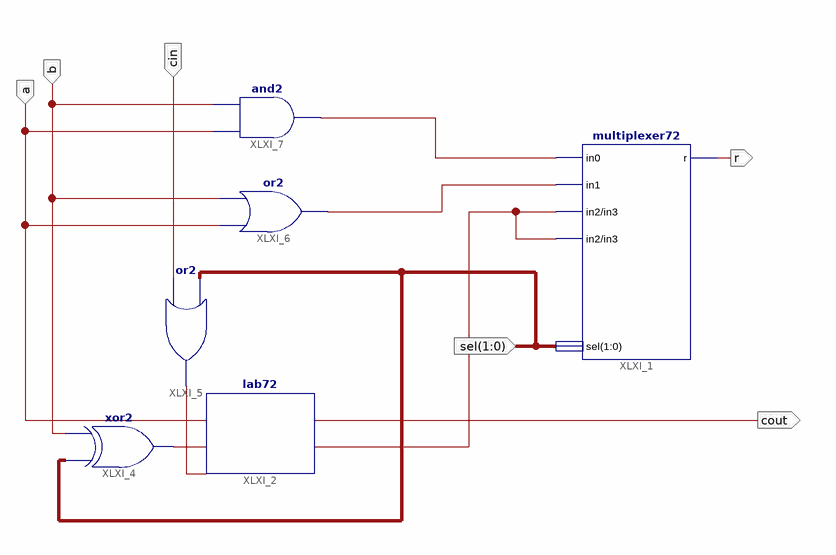
[diagram p0: schematic sheet 1]
// Xilinx ISE schematic lab72sch.sch (artix7) as structural Verilog: 6 symbols, 6 ports
module lab72sch (
  input  b,
  input  cin,
  input  a,
  input  [1:0] sel,
  output r,
  output cout
);

  wire XLXN_3, XLXN_6, XLXN_7, XLXN_8, XLXN_9;

  multiplexer72 XLXI_1 (.in0(XLXN_9), .in1(XLXN_8), .in2(XLXN_3), .in3(XLXN_3), .sel(sel), .r(r));
  lab72 XLXI_2 ();  // open: a, b, cin, cout, s
  assign XLXN_6 = sel ^ {2{b}};  // xor2 XLXI_4, 2 bits wide
  assign XLXN_7 = {2{cin}} | sel;  // or2 XLXI_5, 2 bits wide
  or XLXI_6 (XLXN_8, a, b);
  and XLXI_7 (XLXN_9, a, b);
endmodule
